# Altium project motordriver-v5.2.PrjPcb (part 1 of 3)
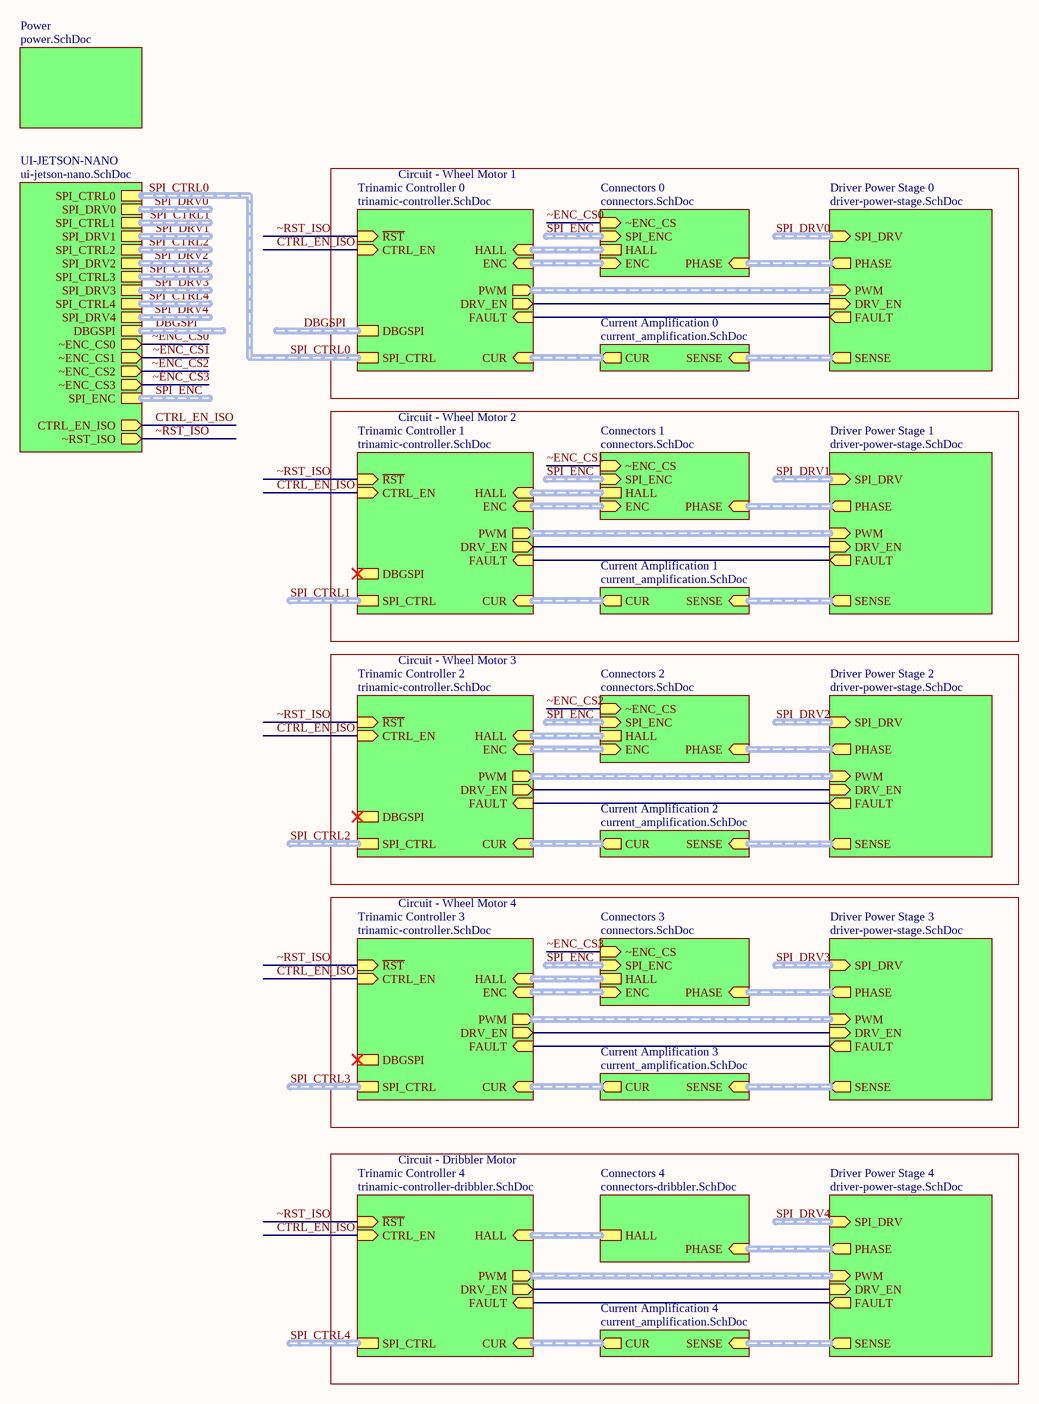
[diagram p0: motordriver-v5.1_top-level.SchDoc]
13 sheets, 777 parts. Net scope: hierarchical (ports join the sheet entries above them; power ports are global).
Board files: motordriver-v5.2.PcbDoc, motordriver-v5.2 - panel.PcbDoc
Sheets:
  motordriver-v5.1_top-level.SchDoc
    Driver Power Stage 0 = driver-power-stage.SchDoc
    Trinamic Controller 0 = trinamic-controller.SchDoc
    Connectors 0 = connectors.SchDoc
    Current Amplification 0 = current_amplification.SchDoc
    Power = power.SchDoc
    UI-JETSON-NANO = ui-jetson-nano.SchDoc
      LP Filter 0 = low-pass-filter.SchDoc
      U_isolation_0 = isolation.SchDoc
      U_isolation_1 = isolation.SchDoc
      U_isolation_2 = isolation-alt.SchDoc
      Demux 0 = demux.SchDoc
      Demux 1 = demux.SchDoc
      Demux 2 = demux.SchDoc
      Demux 3 = demux.SchDoc
      Demux 4 = demux.SchDoc
      U_isolation_3 = isolation-alt.SchDoc
      LP Filter 1 = low-pass-filter.SchDoc
      LP Filter 3 = low-pass-filter.SchDoc
      LP Filter 4 = low-pass-filter.SchDoc
      LP Filter 5 = low-pass-filter.SchDoc
      LP Filter 6 = low-pass-filter.SchDoc
      LP Filter 7 = low-pass-filter.SchDoc
      LP Filter 8 = low-pass-filter.SchDoc
      LP Filter 9 = low-pass-filter.SchDoc
      LP Filter 10 = low-pass-filter.SchDoc
      LP Filter 2 = low-pass-filter.SchDoc
      LP Filter 11 = low-pass-filter.SchDoc
    Driver Power Stage 4 = driver-power-stage.SchDoc
    Trinamic Controller 4 = trinamic-controller-dribbler.SchDoc
    Connectors 4 = connectors-dribbler.SchDoc
    Current Amplification 4 = current_amplification.SchDoc
    Driver Power Stage 1 = driver-power-stage.SchDoc
    Trinamic Controller 1 = trinamic-controller.SchDoc
    Connectors 1 = connectors.SchDoc
    Current Amplification 1 = current_amplification.SchDoc
    Driver Power Stage 2 = driver-power-stage.SchDoc
    Trinamic Controller 2 = trinamic-controller.SchDoc
    Connectors 2 = connectors.SchDoc
    Current Amplification 2 = current_amplification.SchDoc
    Driver Power Stage 3 = driver-power-stage.SchDoc
    Trinamic Controller 3 = trinamic-controller.SchDoc
    Connectors 3 = connectors.SchDoc
    Current Amplification 3 = current_amplification.SchDoc

## Sheet motordriver-v5.1_top-level.SchDoc
size 420 x 297 mm; SheetNumber: 1; SheetTotal: 13

### Sub-sheets
Connectors 0 = connectors.SchDoc: PHASE (in, harness PHASE), HALL (harness HALL), ENC (in, harness ENC), SPI_ENC (in, harness SPI_ENC), ~ENC_CS (in)
Connectors 1 = connectors.SchDoc: PHASE (in, harness PHASE), HALL (harness HALL), ENC (in, harness ENC), SPI_ENC (in, harness SPI_ENC), ~ENC_CS (in)
Connectors 2 = connectors.SchDoc: PHASE (in, harness PHASE), HALL (harness HALL), ENC (in, harness ENC), SPI_ENC (in, harness SPI_ENC), ~ENC_CS (in)
Connectors 3 = connectors.SchDoc: PHASE (in, harness PHASE), HALL (harness HALL), ENC (in, harness ENC), SPI_ENC (in, harness SPI_ENC), ~ENC_CS (in)
Connectors 4 = connectors-dribbler.SchDoc: PHASE (in, harness PHASE), HALL (harness HALL)
Current Amplification 0 = current_amplification.SchDoc: SENSE (in, harness SENSE), CUR (out, harness CUR)
Current Amplification 1 = current_amplification.SchDoc: SENSE (in, harness SENSE), CUR (out, harness CUR)
Current Amplification 2 = current_amplification.SchDoc: SENSE (in, harness SENSE), CUR (out, harness CUR)
Current Amplification 3 = current_amplification.SchDoc: SENSE (in, harness SENSE), CUR (out, harness CUR)
Current Amplification 4 = current_amplification.SchDoc: SENSE (in, harness SENSE), CUR (out, harness CUR)
Driver Power Stage 0 = driver-power-stage.SchDoc: DRV_EN (in), PWM (in, harness PWM), FAULT (out), SENSE (out, harness SENSE), PHASE (out, harness PHASE), SPI_DRV (in, harness DRV)
Driver Power Stage 1 = driver-power-stage.SchDoc: DRV_EN (in), PWM (in, harness PWM), FAULT (out), SENSE (out, harness SENSE), PHASE (out, harness PHASE), SPI_DRV (in, harness DRV)
Driver Power Stage 2 = driver-power-stage.SchDoc: DRV_EN (in), PWM (in, harness PWM), FAULT (out), SENSE (out, harness SENSE), PHASE (out, harness PHASE), SPI_DRV (in, harness DRV)
Driver Power Stage 3 = driver-power-stage.SchDoc: DRV_EN (in), PWM (in, harness PWM), FAULT (out), SENSE (out, harness SENSE), PHASE (out, harness PHASE), SPI_DRV (in, harness DRV)
Driver Power Stage 4 = driver-power-stage.SchDoc: DRV_EN (in), PWM (in, harness PWM), FAULT (out), SENSE (out, harness SENSE), PHASE (out, harness PHASE), SPI_DRV (in, harness DRV)
Power = power.SchDoc: no entries
Trinamic Controller 0 = trinamic-controller.SchDoc: ~{RST} (in), CUR (in, harness CUR), DRV_EN (out), CTRL_EN (in), PWM (out, harness PWM), HALL (in, harness HALL), FAULT (in), ENC (in, harness ENC), SPI_CTRL (harness CTRL), DBGSPI (harness DRV)
Trinamic Controller 1 = trinamic-controller.SchDoc: ~{RST} (in), CUR (in, harness CUR), DRV_EN (out), CTRL_EN (in), PWM (out, harness PWM), HALL (in, harness HALL), FAULT (in), ENC (in, harness ENC), SPI_CTRL (harness CTRL), DBGSPI (harness DRV)
Trinamic Controller 2 = trinamic-controller.SchDoc: ~{RST} (in), CUR (in, harness CUR), DRV_EN (out), CTRL_EN (in), PWM (out, harness PWM), HALL (in, harness HALL), FAULT (in), ENC (in, harness ENC), SPI_CTRL (harness CTRL), DBGSPI (harness DRV)
Trinamic Controller 3 = trinamic-controller.SchDoc: ~{RST} (in), CUR (in, harness CUR), DRV_EN (out), CTRL_EN (in), PWM (out, harness PWM), HALL (in, harness HALL), FAULT (in), ENC (in, harness ENC), SPI_CTRL (harness CTRL), DBGSPI (harness DRV)
Trinamic Controller 4 = trinamic-controller-dribbler.SchDoc: ~{RST} (in), CUR (in, harness CUR), DRV_EN (out), CTRL_EN (in), PWM (out, harness PWM), HALL (in, harness HALL), FAULT (in), SPI_CTRL (harness CTRL)
UI-JETSON-NANO = ui-jetson-nano.SchDoc: SPI_CTRL0 (harness CTRL), SPI_DRV0 (harness DRV), SPI_ENC (harness SPI_ENC), ~ENC_CS0 (out), ~ENC_CS1 (out), ~ENC_CS2 (out), ~ENC_CS3 (out), SPI_CTRL4 (harness CTRL), SPI_CTRL1 (harness CTRL), SPI_DRV1 (harness DRV), SPI_CTRL2 (harness CTRL), SPI_DRV2 (harness DRV), SPI_CTRL3 (harness CTRL), SPI_DRV3 (harness DRV), SPI_DRV4 (harness DRV), ~RST_ISO (out), CTRL_EN_ISO (out), DBGSPI (harness DRV)

### Nets
CTRL_EN_ISO: sheet Trinamic Controller 0/CTRL_EN, sheet UI-JETSON-NANO/CTRL_EN_ISO, sheet Trinamic Controller 4/CTRL_EN, sheet Trinamic Controller 1/CTRL_EN, sheet Trinamic Controller 2/CTRL_EN, sheet Trinamic Controller 3/CTRL_EN
DRV_EN: sheet Driver Power Stage 0/DRV_EN, sheet Trinamic Controller 0/DRV_EN
DRV_EN: sheet Driver Power Stage 4/DRV_EN, sheet Trinamic Controller 4/DRV_EN  [a separate net that carries the same name]
DRV_EN: sheet Driver Power Stage 1/DRV_EN, sheet Trinamic Controller 1/DRV_EN  [a separate net that carries the same name]
DRV_EN: sheet Driver Power Stage 2/DRV_EN, sheet Trinamic Controller 2/DRV_EN  [a separate net that carries the same name]
DRV_EN: sheet Driver Power Stage 3/DRV_EN, sheet Trinamic Controller 3/DRV_EN  [a separate net that carries the same name]
FAULT: sheet Driver Power Stage 0/FAULT, sheet Trinamic Controller 0/FAULT
FAULT: sheet Driver Power Stage 4/FAULT, sheet Trinamic Controller 4/FAULT  [a separate net that carries the same name]
FAULT: sheet Driver Power Stage 1/FAULT, sheet Trinamic Controller 1/FAULT  [a separate net that carries the same name]
FAULT: sheet Driver Power Stage 2/FAULT, sheet Trinamic Controller 2/FAULT  [a separate net that carries the same name]
FAULT: sheet Driver Power Stage 3/FAULT, sheet Trinamic Controller 3/FAULT  [a separate net that carries the same name]
~ENC_CS0: sheet Connectors 0/~ENC_CS, sheet UI-JETSON-NANO/~ENC_CS0
~ENC_CS1: sheet UI-JETSON-NANO/~ENC_CS1, sheet Connectors 1/~ENC_CS
~ENC_CS2: sheet UI-JETSON-NANO/~ENC_CS2, sheet Connectors 2/~ENC_CS
~ENC_CS3: sheet UI-JETSON-NANO/~ENC_CS3, sheet Connectors 3/~ENC_CS
~RST_ISO: sheet Trinamic Controller 0/~{RST}, sheet UI-JETSON-NANO/~RST_ISO, sheet Trinamic Controller 4/~{RST}, sheet Trinamic Controller 1/~{RST}, sheet Trinamic Controller 2/~{RST}, sheet Trinamic Controller 3/~{RST}

### Buses and harness runs
harness DBGSPI = sheet Trinamic Controller 0/DBGSPI
harness DBGSPI = sheet UI-JETSON-NANO/DBGSPI
harness sheet Connectors 0/ENC = sheet Trinamic Controller 0/ENC
harness sheet Connectors 0/HALL = sheet Trinamic Controller 0/HALL
harness sheet Connectors 0/PHASE = sheet Driver Power Stage 0/PHASE
harness sheet Connectors 1/ENC = sheet Trinamic Controller 1/ENC
harness sheet Connectors 1/HALL = sheet Trinamic Controller 1/HALL
harness sheet Connectors 1/PHASE = sheet Driver Power Stage 1/PHASE
harness sheet Connectors 2/ENC = sheet Trinamic Controller 2/ENC
harness sheet Connectors 2/HALL = sheet Trinamic Controller 2/HALL
harness sheet Connectors 2/PHASE = sheet Driver Power Stage 2/PHASE
harness sheet Connectors 3/ENC = sheet Trinamic Controller 3/ENC
harness sheet Connectors 3/HALL = sheet Trinamic Controller 3/HALL
harness sheet Connectors 3/PHASE = sheet Driver Power Stage 3/PHASE
harness sheet Connectors 4/HALL = sheet Trinamic Controller 4/HALL
harness sheet Connectors 4/PHASE = sheet Driver Power Stage 4/PHASE
harness sheet Current Amplification 0/CUR = sheet Trinamic Controller 0/CUR
harness sheet Current Amplification 0/SENSE = sheet Driver Power Stage 0/SENSE
harness sheet Current Amplification 1/CUR = sheet Trinamic Controller 1/CUR
harness sheet Current Amplification 1/SENSE = sheet Driver Power Stage 1/SENSE
harness sheet Current Amplification 2/CUR = sheet Trinamic Controller 2/CUR
harness sheet Current Amplification 2/SENSE = sheet Driver Power Stage 2/SENSE
harness sheet Current Amplification 3/CUR = sheet Trinamic Controller 3/CUR
harness sheet Current Amplification 3/SENSE = sheet Driver Power Stage 3/SENSE
harness sheet Current Amplification 4/CUR = sheet Trinamic Controller 4/CUR
harness sheet Current Amplification 4/SENSE = sheet Driver Power Stage 4/SENSE
harness sheet Driver Power Stage 0/PWM = sheet Trinamic Controller 0/PWM
harness sheet Driver Power Stage 1/PWM = sheet Trinamic Controller 1/PWM
harness sheet Driver Power Stage 2/PWM = sheet Trinamic Controller 2/PWM
harness sheet Driver Power Stage 3/PWM = sheet Trinamic Controller 3/PWM
harness sheet Driver Power Stage 4/PWM = sheet Trinamic Controller 4/PWM
harness SPI_CTRL0 = sheet Trinamic Controller 0/SPI_CTRL = sheet UI-JETSON-NANO/SPI_CTRL0
harness SPI_CTRL1 = sheet Trinamic Controller 1/SPI_CTRL
harness SPI_CTRL1 = sheet UI-JETSON-NANO/SPI_CTRL1
harness SPI_CTRL2 = sheet Trinamic Controller 2/SPI_CTRL
harness SPI_CTRL2 = sheet UI-JETSON-NANO/SPI_CTRL2
harness SPI_CTRL3 = sheet Trinamic Controller 3/SPI_CTRL
harness SPI_CTRL3 = sheet UI-JETSON-NANO/SPI_CTRL3
harness SPI_CTRL4 = sheet Trinamic Controller 4/SPI_CTRL
harness SPI_CTRL4 = sheet UI-JETSON-NANO/SPI_CTRL4
harness SPI_DRV0 = sheet Driver Power Stage 0/SPI_DRV
harness SPI_DRV0 = sheet UI-JETSON-NANO/SPI_DRV0
harness SPI_DRV1 = sheet Driver Power Stage 1/SPI_DRV
harness SPI_DRV1 = sheet UI-JETSON-NANO/SPI_DRV1
harness SPI_DRV2 = sheet Driver Power Stage 2/SPI_DRV
harness SPI_DRV2 = sheet UI-JETSON-NANO/SPI_DRV2
harness SPI_DRV3 = sheet Driver Power Stage 3/SPI_DRV
harness SPI_DRV3 = sheet UI-JETSON-NANO/SPI_DRV3
harness SPI_DRV4 = sheet Driver Power Stage 4/SPI_DRV
harness SPI_DRV4 = sheet UI-JETSON-NANO/SPI_DRV4
harness SPI_ENC = sheet Connectors 0/SPI_ENC
harness SPI_ENC = sheet Connectors 1/SPI_ENC
harness SPI_ENC = sheet Connectors 2/SPI_ENC
harness SPI_ENC = sheet Connectors 3/SPI_ENC
harness SPI_ENC = sheet UI-JETSON-NANO/SPI_ENC

### Notes on the sheet
- Circuit - Wheel Motor 1
- Circuit - Wheel Motor 2
- Circuit - Wheel Motor 3
- Circuit - Wheel Motor 4
- Circuit - Dribbler Motor
- TITLE
- SCALE:
- A3
- SIZE
- FILE NAME
- SHEET
- OF
- REV

## Sheet driver-power-stage.SchDoc
size A4; SheetNumber: 11; SheetTotal: 13
Used 5 times, as channels Driver Power Stage 0, Driver Power Stage 4, Driver Power Stage 1, Driver Power Stage 2, Driver Power Stage 3. Parts and nets are listed once, with the designators drawn on the sheet.
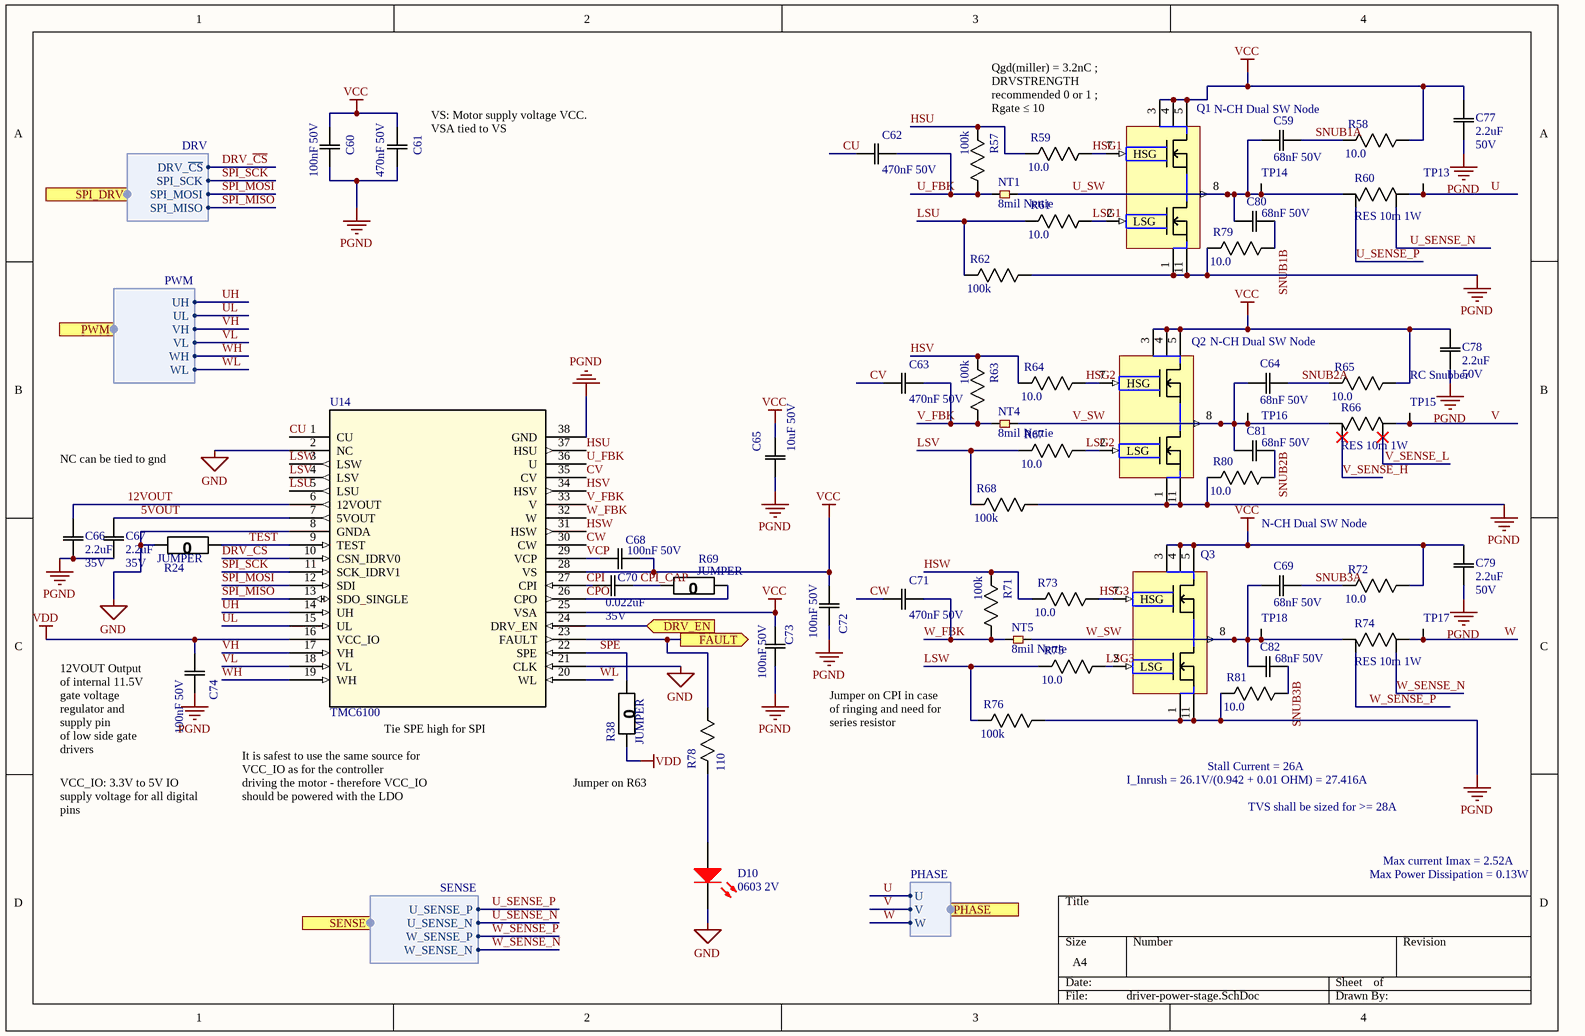
[diagram p1: driver-power-stage.SchDoc]

### Parts
C59  68nF 50V  [0603]
C60  100nF 50V  [0603]
C61  470nF 50V  [0603]
C62  470nF 50V  [0603]
C63  470nF 50V  [0603]
C64  68nF 50V  [0603]
C65  10uF 50V  [0805]
C66  value 2.2uF  Rating: 35V  [0603]  (hidden comment: 2.2uF 35V)
C67  value 2.2uF  Rating: 35V  [0603]  (hidden comment: 2.2uF 35V)
C68  100nF 50V  [0603]
C69  68nF 50V  [0603]
C70  value 0.022uF  Rating: 35V  [0603]  (hidden comment: 0.022uF 35V)
C71  470nF 50V  [0603]
C72  100nF 50V  [0603]
C73  100nF 50V  [0603]
C74  100nF 50V  [0603]
C77  Rating: 50V  [0603]  (hidden comment: 2.2uF)
C78  Rating: 50V  [0603]  (hidden comment: 2.2uF)
C79  Rating: 50V  [0603]  (hidden comment: 2.2uF)
C80  68nF 50V  [0603]
C81  68nF 50V  [0603]
C82  68nF 50V  [0603]
D10  0603 2V  [0603 - LED2]
NT1  8mil Nettie  [NT_8mil]  (net tie, no BOM)
NT4  8mil Nettie  [NT_8mil]  (net tie, no BOM)
NT5  8mil Nettie  [NT_8mil]  (net tie, no BOM)
Q1  N-CH Dual SW Node  [12-PowerWQFN]
Q2  N-CH Dual SW Node  [12-PowerWQFN]
Q3  N-CH Dual SW Node  [12-PowerWQFN]
R24  JUMPER  [0603]
R38  JUMPER  [0603]
R57  100k  [0603]
R58  10.0  [0603]
R59  10.0  [0603]
R60  RES 10m 1W  [1206 - Current Sense]
R61  10.0  [0603]
R62  100k  [0603]
R63  100k  [0603]
R64  10.0  [0603]
R65  10.0  [0603]
R66  RES 10m 1W  [1206 - Current Sense]
R67  10.0  [0603]
R68  100k  [0603]
R69  JUMPER  [0603]
R71  100k  [0603]
R72  10.0  [0603]
R73  10.0  [0603]
R74  RES 10m 1W  [1206 - Current Sense]
R75  10.0  [0603]
R76  100k  [0603]
R78  110  [0603]
R79  10.0  [0603]
R80  10.0  [0603]
R81  10.0  [0603]
TP13  U_SL  [TP]  (value not drawn)  (no BOM)
TP14  U_SH  [TP]  (value not drawn)  (no BOM)
TP15  V_SL  [TP]  (value not drawn)  (no BOM)
TP16  V_SH  [TP]  (value not drawn)  (no BOM)
TP17  W_SL  [TP]  (value not drawn)  (no BOM)
TP18  W_SH  [TP]  (value not drawn)  (no BOM)
U14  TMC6100  [QFN50P700X700X85_HS-38N]

### Ports
DRV_EN (in), FAULT (out), PHASE (harness PHASE), PWM (harness PWM), SENSE (harness SENSE), SPI_DRV (harness DRV)

### Harnesses
PWM: VL, WH, WL, VH, UL, UH
SENSE: U_SENSE_P, U_SENSE_N, W_SENSE_P, W_SENSE_N
PHASE: U, V, W
DRV: SPI_SCK, SPI_MISO, SPI_MOSI, DRV_~{CS}

### Nets
GND: D10.2(K) R24.2(R2) U14.2(NC) U14.8(GNDA) U14.21(CLK)
PGND: C60.2(C2) C61.2(C2) C65.1(C1) C66.1(C1) C67.1(C1) C72.2(C2) C73.2(C2) C74.2(C2) C77.1(C1) C78.1(C1) C79.1(C1) Q1.1(GND) Q1.11(GND) Q2.1(GND) Q2.11(GND) Q3.1(GND) Q3.11(GND) R62.1(R1) R68.1(R1) R76.1(R1) R79.2(R2) R80.2(R2) R81.2(R2) U14.38(GND)
VCC: C60.1(C1) C61.1(C1) C65.2(C2) C68.2(C2) C72.1(C1) C73.1(C1) C77.2(C2) C78.2(C2) C79.2(C2) Q1.3(V+) Q1.4(V+) Q1.5(V+) Q2.3(V+) Q2.4(V+) Q2.5(V+) Q3.3(V+) Q3.4(V+) Q3.5(V+) R58.1(R1) R65.1(R1) R72.1(R1) U14.25(VSA) U14.28(VS)
VDD: C74.1(C1) R38.2(R2) U14.16(VCC_IO)
5VOUT: C67.2(C2) U14.7(5VOUT)
12VOUT: C66.2(C2) U14.6(12VOUT)
CPI: C70.1(C1) U14.27(CPI)
CPI_CAP: C70.2(C2) R69.2(R2)
CPO: R69.1(R1) U14.26(CPO)
CU: C62.1(C1) U14.1(CU)
CV: C63.1(C1) U14.35(CV)
CW: C71.1(C1) U14.30(CW)
DRV_~{CS}: U14.10(CSN_IDRV0) ; port SPI_DRV.DRV_~{CS}
DRV_EN: U14.24(DRV_EN) ; port DRV_EN
FAULT: R78.1(R1) U14.23(FAULT) ; port FAULT
HSG1: Q1.7(HSG) R59.1(R1)
HSG2: Q2.7(HSG) R64.1(R1)
HSG3: Q3.7(HSG) R73.1(R1)
HSU: R57.2(R2) R59.2(R2) U14.37(HSU)
HSV: R63.2(R2) R64.2(R2) U14.34(HSV)
HSW: R71.2(R2) R73.2(R2) U14.31(HSW)
LSG1: Q1.2(LSG) R61.1(R1)
LSG2: Q2.2(LSG) R67.1(R1)
LSG3: Q3.2(LSG) R75.1(R1)
LSU: R61.2(R2) R62.2(R2) U14.5(LSU)
LSV: R67.2(R2) R68.2(R2) U14.4(LSV)
LSW: R75.2(R2) R76.2(R2) U14.3(LSW)
SNUB1A: C59.2(C2) R58.2(R2)
SNUB1B: C80.2(C2) R79.1(R1)
SNUB2A: C64.2(C2) R65.2(R2)
SNUB2B: C81.2(C2) R80.1(R1)
SNUB3A: C69.2(C2) R72.2(R2)
SNUB3B: C82.2(C2) R81.1(R1)
SPE: R38.1(R1) U14.22(SPE)
SPI_MISO: U14.13(SDO_SINGLE) ; port SPI_DRV.SPI_MISO
SPI_MOSI: U14.12(SDI) ; port SPI_DRV.SPI_MOSI
SPI_SCK: U14.11(SCK_IDRV1) ; port SPI_DRV.SPI_SCK
TEST: R24.1(R1) U14.9(TEST)
U: R60.1(R1) TP13.1 ; port PHASE.U
U_FBK: C62.2(C2) NT1.2 R57.1(R1) U14.36(U)
U_SENSE_N: R60.S1 ; port SENSE.U_SENSE_N
U_SENSE_P: R60.S2 ; port SENSE.U_SENSE_P
U_SW: C59.1(C1) C80.1(C1) NT1.1 Q1.8(SW) R60.2(R2) TP14.1
UH: U14.14(UH) ; port PWM.UH
UL: U14.15(UL) ; port PWM.UL
V: R66.1(R1) TP15.1 ; port PHASE.V
V_FBK: C63.2(C2) NT4.2 R63.1(R1) U14.33(V)
V_SENSE_H: R66.S2
V_SENSE_L: R66.S1
V_SW: C64.1(C1) C81.1(C1) NT4.1 Q2.8(SW) R66.2(R2) TP16.1
VCP: C68.1(C1) U14.29(VCP)
VH: U14.17(VH) ; port PWM.VH
VL: U14.18(VL) ; port PWM.VL
W: R74.1(R1) TP17.1 ; port PHASE.W
W_FBK: C71.2(C2) NT5.2 R71.1(R1) U14.32(W)
W_SENSE_N: R74.S1 ; port SENSE.W_SENSE_N
W_SENSE_P: R74.S2 ; port SENSE.W_SENSE_P
W_SW: C69.1(C1) C82.1(C1) NT5.1 Q3.8(SW) R74.2(R2) TP18.1
WH: U14.19(WH) ; port PWM.WH
WL: U14.20(WL) ; port PWM.WL
NetD10_1: D10.1(A) R78.2(R2)

### Channels
Driver Power Stage 0: designators end in A; ports DRV_EN=DRV_EN FAULT=FAULT
Driver Power Stage 4: designators end in B; ports DRV_EN=DRV_EN FAULT=FAULT
Driver Power Stage 1: designators end in C; ports DRV_EN=DRV_EN FAULT=FAULT
Driver Power Stage 2: designators end in D; ports DRV_EN=DRV_EN FAULT=FAULT
Driver Power Stage 3: designators end in E; ports DRV_EN=DRV_EN FAULT=FAULT

### Notes on the sheet
- Text
- (near Q1) Qgd(miller) = 3.2nC ; DRVSTRENGTH recommended 0 or 1 ; Rgate ≤ 10
- (near C61) VS: Motor supply voltage VCC. VSA tied to VS
- (near C78) RC Snubber
- NC can be tied to gnd
- (near C74) 12VOUT Output of internal 11.5V gate voltage regulator and supply pin
  of low side gate drivers
- Tie SPE high for SPI
- Jumper on CPI in case of ringing and need for series resistor
- I_Inrush = 26.1V/(0.942 + 0.01 OHM) = 27.416A
- Stall Current = 26A
- VCC_IO: 3.3V to 5V IO supply voltage for all digital pins
- It is safest to use the same source for VCC_IO as for the controller
  driving the motor - therefore VCC_IO should be powered with the LDO
- Jumper on R63
- TVS shall be sized for >= 28A
- Max Power Dissipation = 0.13W
- Max current Imax = 2.52A

### Library data of the parts
C59 C64 C69 C80-C82 = CAP 0.068uF 50V: Default Symbol for Capacitors; Temperature Coefficient: X7R; Tolerance: 10%; Part Number: CAP 0.068uF 50V; Value: 0.068uF; Rating: 50V
C60 C68 C72-C74 = CAP 100nF 50V: Default Symbol for Capacitors; Manufacturer Part Number 1: CC0603KPX7R9BB104; Tolerance: 10%; Temperature Coefficient: X7R; VALUE: 100nF; Rating: 50V; Part Number: CAP 100nF 50V; Supplier 1: Digi-Key; Supplier Part Number 1: 311-3567-1-ND; Manufacturer Part Number 2: 0805J0500104KJT; Supplier 2: Digi-Key; Supplier Part Number 2: 1608-1458-1-ND
C61-C63 C71 = CAP 470nF 50V: Default Symbol for Capacitors; Manufacturer Part Number 1: C1608X7R1H474K080AC; Tolerance: 10%; Temperature Coefficient: X7R; VALUE: 470nF; Rating: 50V; Part Number: CAP 470nF 50V; Supplier 1: Digi-Key; Supplier Part Number 1: 445-5952-1-ND; Manufacturer Part Number 2: CL21B474KBFNNNG; Supplier 2: Digi-Key; Supplier Part Number 2: 1276-6482-1-ND
C65 = CAP 10uF 50V: Default Symbol for Capacitors; Manufacturer Part Number 1: GRM21BR61H106KE43L; Tolerance: 10%; Temperature Coefficient: X5R; VALUE: 10uF; Rating: 50V; Part Number: CAP 10uF 50V; Supplier 1: Digi-Key; Supplier Part Number 1: 490-18663-1-ND; Manufacturer Part Number 2: CL32B106KBJNNWE; Supplier 2: Digi-Key; Supplier Part Number 2: 1276-3388-1-ND
C66 C67 = CAP 2.2uF 35V: Default Symbol for Capacitors; Manufacturer Part Number 1: C1608X5R1V225K080AC; Tolerance: 10%; Temperature Coefficient: X5R; Part Number: CAP 2.2uF 35V; Supplier 1: Digi-Key; Supplier Part Number 1: 445-8025-1-ND; Manufacturer Part Number 2: CGA4J1X7R1V225K125AE; Supplier 2: Digi-Key; Supplier Part Number 2: 445-8787-1-ND
C70 = CAP 0.022uF 35V: Default Symbol for Capacitors; Manufacturer Part Number 1: GMK107BJ223KAHT; Tolerance: 10%; Temperature Coefficient: X7R; Part Number: CAP 0.022uF 35V; Supplier 1: Digi-Key; Supplier Part Number 1: 587-3359-1-ND; Manufacturer Part Number 2: GMK212SD223KG-T; Supplier 2: Digi-Key; Supplier Part Number 2: 587-1122-1-ND
C77-C79 = CAP 2.2uF 50V: CAP CER 2.2UF 50V X5R 0603/0805; Manufacturer Part Number 1: GRM188R61H225KE11D; Tolerance: 10%; Package: 0603/0805; Temperature Coefficient: X5R; Operating Temperature: -55°C ~ 125°C; Value: 2.2uF; Part Number: CAP 2.2uF 50V; Supplier 1: Mouser; Supplier Part Number 1: 81-GRM188R61H225KE1D
D10 = LED RED SMD 0603: 0603 red led alingap 631nm-639nm water clear 18-180mcd 130d; Manufacturer Part Number 1: LTST-C190KRKT; Current Rating: 20mA; Supplier 1: Digi-Key; Supplier Part Number 1: 160-1436-1-ND; Part Number: LED RED SMD 0603; Supplier URL 1: https://www.digikey.ca/en/products/detail/lite-on-inc/LTST-C190KRKT/386817?s=N4IgTCBcDaIIwDYAMBaOAWAzAtKByAIiALoC%2BQA; Pin Count: 2; Voltage Rating - DC: 2V
NT1 NT4 NT5 = NT_8: 74LVC Series 5.5 V SMT 2-Channel Analog Multiplexer/Demultiplexer - TSSOP-8; Manufacturer Part Number 1: 74LVC1G53DP,125; Part Number: NT_8; Supplier 1: Digi-Key; Supplier Part Number 1: 1727-6078-1-ND; Supplier URL 1: https://www.digikey.ca/en/products/detail/nexperia-usa-inc/74LVC1G53DP-125/1300844
Q1-Q3 = MOSFET N-CH DUAL NTTFD4D0N04HLTWG: MOSFET N+N COMMON PHASE SW 40V 60A; Supplier 1: Digi-Key; Supplier Part Number 1: 488-NTTFD4D0N04HLTWGCT-ND; Part Number: MOSFET N-CH DUAL NTTFD4D0N04HLTWG; Supplier URL 1: https://www.digikey.ca/en/products/detail/onsemi/NTTFD4D0N04HLTWG/12181286?s=N4IgTCBcDaIHIBUEDEAiAWVAGOX0AkAZBAdQHEBhBEAXQF8g; Manufacturer Part Number 1: NTTFD4D0N04HLTWG
R24 R38 R69 = RES 0 JUMPER: RES SMD 0 OHM JUMPER GENERIC 0805; Manufacturer Part Number 1: RK73Z1JTTD; VALUE: 0; Package: 0805; Part Number: RES 0 JUMPER; Supplier 1: Digi-Key; Supplier Part Number 1: 2019-RK73Z1JTTDCT-ND; Supplier URL 1: https://www.digikey.ca/en/products/detail/koa-speer-electronics-inc/RK73Z1JTTD/9845478; Tolerance: N/A
R57 R62 R63 R68 R71 R76 = RES 100k 1/8W 5%: RES SMD 100K OHM 5% 1/8W 0805; Power (Watts): 0.125W; Package: 0805; VALUE: 100k; Tolerance: 5%; Part Number: RES 100k 1/8W 5%
R58 R59 R61 R64 R65 R67 R72 R73 R75 R79-R81 = RES 10.0 1/8W - 1%: Default Resistor Symbol; Manufacturer Part Number 1: RNCP0603FTD10R0; VALUE: 10; Power (Watts): 0.125W; Tolerance: 1%; Package: 0805; Part Number: RES 10.0 1/8W - 1%; Supplier 1: Digi-Key; Supplier Part Number 1: RNCP0603FTD10R0CT-ND; Manufacturer Part Number 2: RNCP0603FTD10R0; Supplier 2: Digi-Key; Supplier Part Number 2: RNCP0603FTD10R0CT-ND; Tolerance 2: 1%; Supplier URL 1: https://www.digikey.ca/en/products/detail/stackpole-electronics-inc/RNCP0603FTD10R0/2240074?s=N4IgTCBcDaIEoDkDCAFADANjQZgGIBUARARjTjSXxAF0BfIA; Supplier URL 2: https://www.digikey.ca/en/products/detail/stackpole-electronics-inc/RNCP0603FTD10R0/2240074?s=N4IgTCBcDaIEoDkDCAFADANjQZgGIBUARARjTjSXxAF0BfIA
R60 R66 R74 = RES 10m 1W: RES SMD 0.01 OHM 1% 1W 1206; Manufacturer Part Number 1: CSRL1-0R01F8; Part Number: RES 10m 1W; Value: 10m; Tolerance: 1%; Supplier 1: Digi-Key; Supplier Part Number 1: 696-1845-1-ND; Supplier URL 1: https://www.digikey.ca/en/products/detail/riedon/CSRL1-0R01F8/9666060?s=N4IgTCBcDaIGwE44FoCMAOALAVjcgcgCIgC6AvkA
R78 = RES 110.0 1/8W - 1%: Default Resistor Symbol; Manufacturer Part Number 1: RMCF0603FT110R; Power (Watts): 0.125W; Tolerance: 1%; Package: 0805; Value: 110; Part Number: RES 110.0 1/8W - 1%; Supplier 1: Digi-Key; Supplier Part Number 1: RMCF0603FT110RCT-ND; Supplier URL 1: https://www.digikey.ca/en/products/detail/stackpole-electronics-inc/RMCF0603FT110R/1761268
TP13-TP18 = Test Point (Via): Part Number: Test Point (Via)
U14 = TMC6100: GATE DRIVER IC 8-60V QFN37; Manufacturer Part Number 1: TMC6100-LA; Supplier 1: Newark; Supplier Part Number 1: 54AH1603; Part Number: TMC6100; Supplier URL 1: https://canada.newark.com/trinamic/tmc6100-la/motor-driver-40-to-125deg-c-rohs/dp/54AH1603?ost=54ah1603

## Sheet trinamic-controller.SchDoc
size B; SheetNumber: 8; SheetTotal: 13
Used 4 times, as channels Trinamic Controller 0, Trinamic Controller 1, Trinamic Controller 2, Trinamic Controller 3. Parts and nets are listed once, with the designators drawn on the sheet.
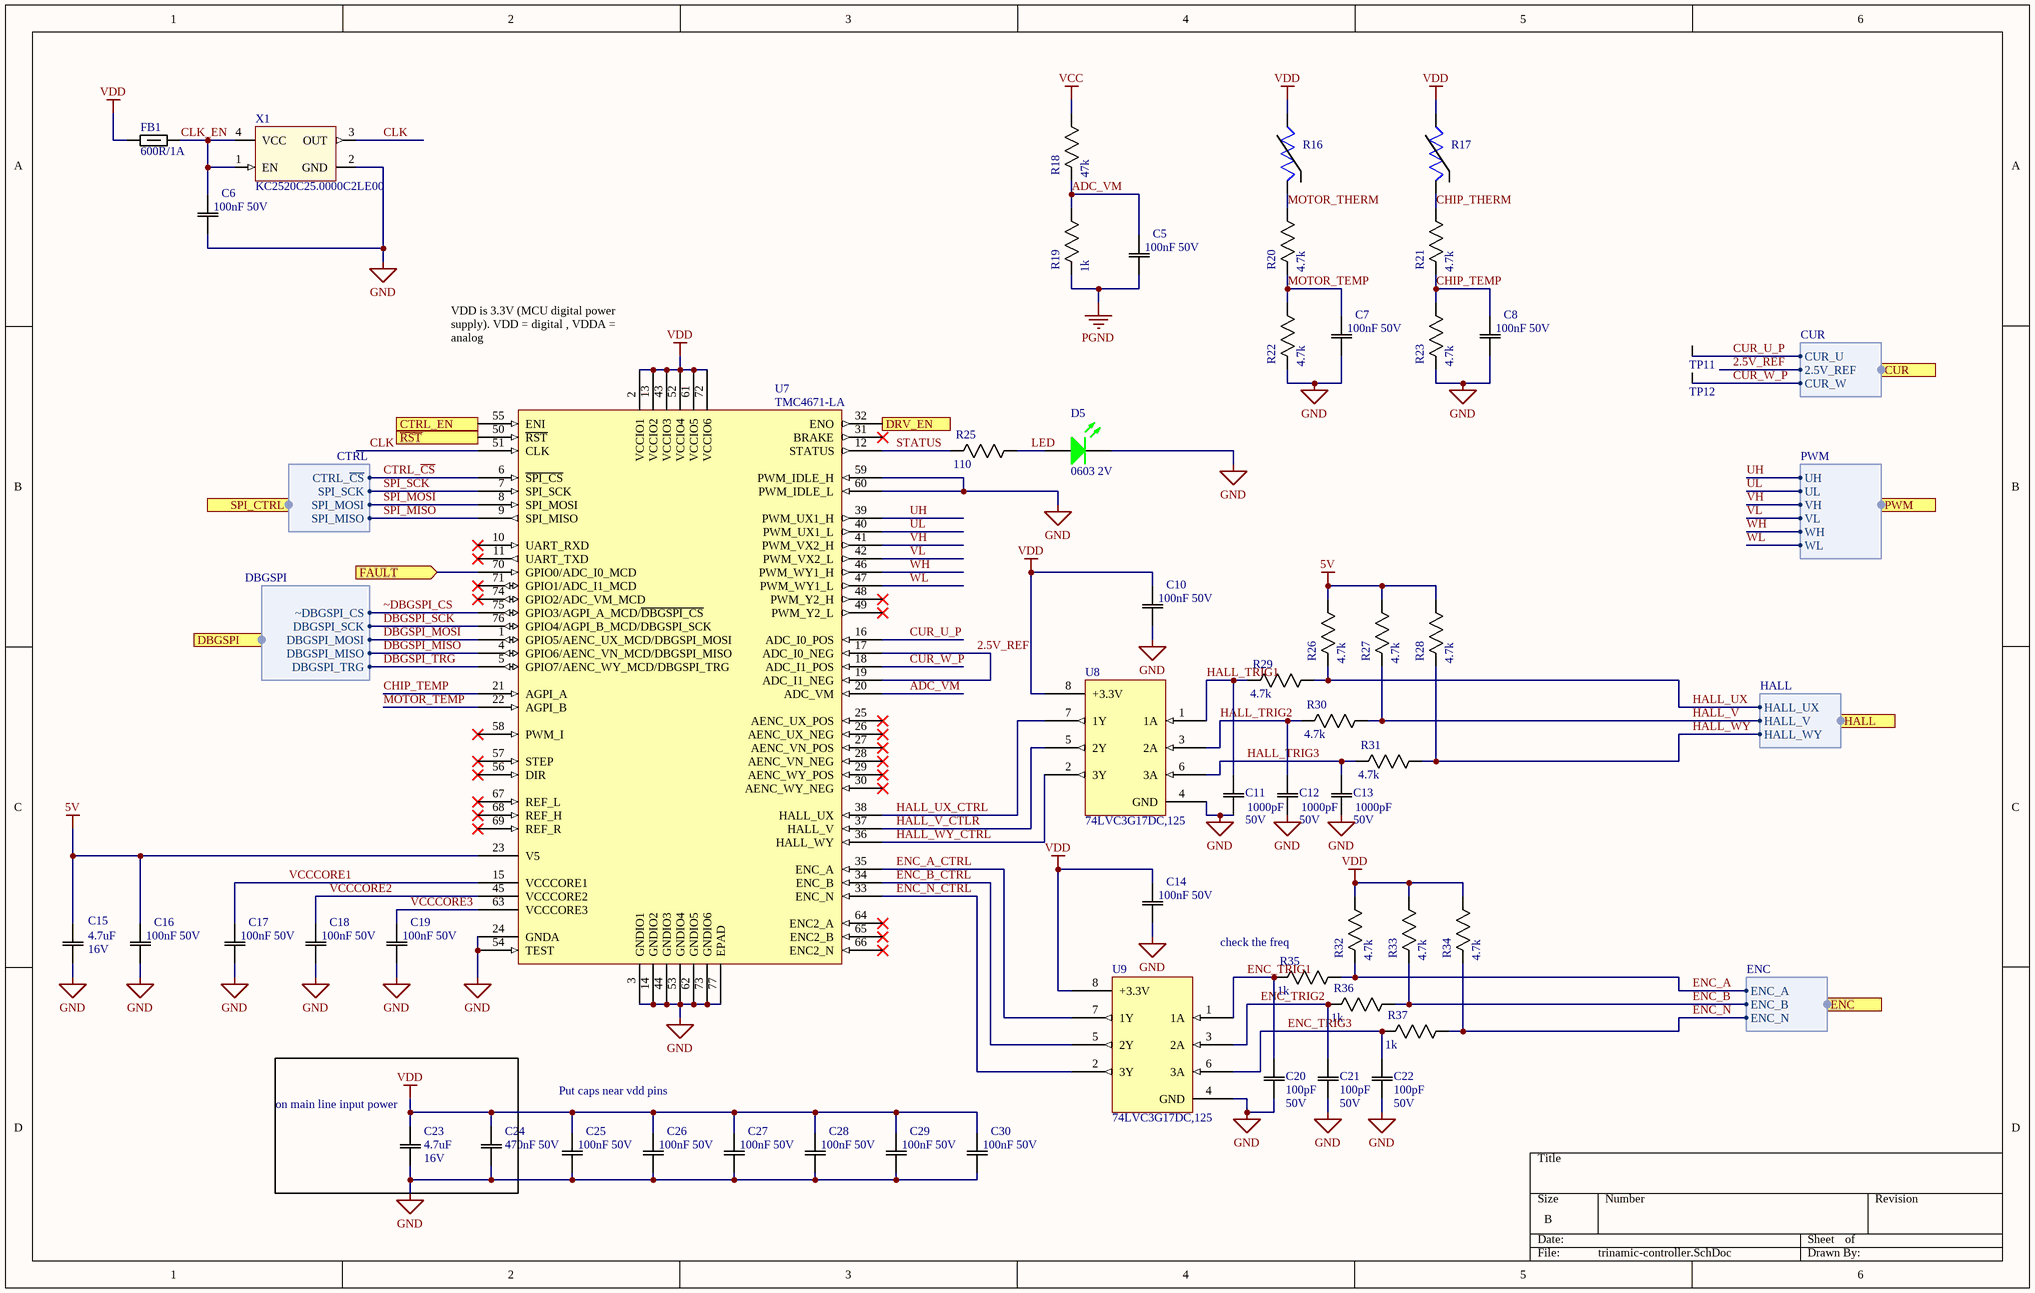
[diagram p2: trinamic-controller.SchDoc]

### Parts
C5  100nF 50V  [0603]
C6  100nF 50V  [0603]
C7  100nF 50V  [0603]
C8  100nF 50V  [0603]
C10  100nF 50V  [0603]
C11  value 1000pF  Rating: 50V  [0603]  (hidden comment: 1000pF 50V)
C12  value 1000pF  Rating: 50V  [0603]  (hidden comment: 1000pF 50V)
C13  value 1000pF  Rating: 50V  [0603]  (hidden comment: 1000pF 50V)
C14  100nF 50V  [0603]
C15  value 4.7uF  Rating: 16V  [0603]  (hidden comment: 4.7uF 16V)
C16  100nF 50V  [0603]
C17  100nF 50V  [0603]
C18  100nF 50V  [0603]
C19  100nF 50V  [0603]
C20  value 100pF  Rating: 50V  [0603]  (hidden comment: 100pF 50V)
C21  value 100pF  Rating: 50V  [0603]  (hidden comment: 100pF 50V)
C22  value 100pF  Rating: 50V  [0603]  (hidden comment: 100pF 50V)
C23  value 4.7uF  Rating: 16V  [0603]  (hidden comment: 4.7uF 16V)
C24  470nF 50V  [0603]
C25  100nF 50V  [0603]
C26  100nF 50V  [0603]
C27  100nF 50V  [0603]
C28  100nF 50V  [0603]
C29  100nF 50V  [0603]
C30  100nF 50V  [0603]
D5  0603 2V  [0603 - LED]
FB1  600R/1A  [0603]
R16  RES NTC 10k  [THERMISTOR TH]  (value not drawn)  (no BOM)
R17  RES NTC 10k  [0603]  (value not drawn)
R18  47k  [0603]
R19  1k  [0603]
R20  4.7k  [0603]
R21  4.7k  [0603]
R22  4.7k  [0603]
R23  4.7k  [0603]
R25  110  [0603]
R26  4.7k  [0603]
R27  4.7k  [0603]
R28  4.7k  [0603]
R29  4.7k  [0603]
R30  4.7k  [0603]
R31  4.7k  [0603]
R32  4.7k  [0603]
R33  4.7k  [0603]
R34  4.7k  [0603]
R35  1k  [0603]
R36  1k  [0603]
R37  1k  [0603]
TP11  C_U  [TP]  (value not drawn)  (no BOM)
TP12  C_W  [TP]  (value not drawn)  (no BOM)
U7  TMC4671-LA  [QFN40P1050X650X90_HS-77N]
U8  74LVC3G17DC,125  [8-VSSOP]
U9  74LVC3G17DC,125  [8-VSSOP]
X1  KC2520C25.0000C2LE00  [KC2520C25.0000C2LE00]

### Blocks framed on the sheet
on main line input power: C23 C24

### Ports
CTRL_EN (in), CUR (harness CUR), DBGSPI (harness DBGSPI), DRV_EN (out), ENC (harness ENC), FAULT (in), HALL (harness HALL), PWM (harness PWM), SPI_CTRL (harness CTRL), ~{RST} (in)

### Harnesses
CUR: CUR_U, CUR_W, 2.5V_REF
PWM: VL, WH, WL, VH, UL, UH
HALL: HALL_UX, HALL_WY, HALL_V
ENC: ENC_A, ENC_N, ENC_B
CTRL: SPI_SCK, SPI_MISO, SPI_MOSI, CTRL_~{CS}
DBGSPI: ~DBGSPI_CS, DBGSPI_SCK, DBGSPI_MOSI, DBGSPI_MISO, DBGSPI_TRG

### Nets
5V: C15.2(C2) C16.2(C2) R26.1(R1) R27.1(R1) R28.1(R1) U7.23(V5)
GND: C6.1(C1) C7.1(C1) C8.1(C1) C10.1(C1) C11.1(C1) C12.1(C1) C13.1(C1) C14.1(C1) C15.1(C1) C16.1(C1) C17.1(C1) C18.1(C1) C19.1(C1) C20.1(C1) C21.1(C1) C22.1(C1) C23.1(C1) C24.1(C1) C25.1(C1) C26.1(C1) C27.1(C1) C28.1(C1) C29.1(C1) C30.1(C1) D5.2(K) R22.2(R2) R23.2(R2) U7.3(GNDIO1) U7.14(GNDIO2) U7.24(GNDA) U7.44(GNDIO3) U7.53(GNDIO4) U7.54(TEST) U7.59(PWM_IDLE_H) U7.60(PWM_IDLE_L) U7.62(GNDIO5) U7.73(GNDIO6) U7.77(EPAD) U8.4(GND) U9.4(GND) X1.2(GND)
PGND: C5.1(C1) R19.2(R2)
VCC: R18.1(R1)
VDD: C10.2(C2) C14.2(C2) C23.2(C2) C24.2(C2) C25.2(C2) C26.2(C2) C27.2(C2) C28.2(C2) C29.2(C2) C30.2(C2) FB1.1 R16.2 R17.2 R32.1(R1) R33.1(R1) R34.1(R1) U7.2(VCCIO1) U7.13(VCCIO2) U7.43(VCCIO3) U7.52(VCCIO4) U7.61(VCCIO5) U7.72(VCCIO6) U8.8(+3.3V) U9.8(+3.3V)
2.5V_REF: U7.17(ADC_I0_NEG) U7.19(ADC_I1_NEG) ; port CUR.2.5V_REF
ADC_VM: C5.2(C2) R18.2(R2) R19.1(R1) U7.20(ADC_VM)
CHIP_TEMP: C8.2(C2) R21.2(R2) R23.1(R1) U7.21(AGPI_A)
CHIP_THERM: R17.1 R21.1(R1)
CLK: U7.51(CLK) X1.3(OUT)
CLK_EN: C6.2(C2) FB1.2 X1.1(EN) X1.4(VCC)
CTRL_~{CS}: U7.6(~{SPI_CS}) ; port SPI_CTRL.CTRL_~{CS}
CTRL_EN: U7.55(ENI) ; port CTRL_EN
CUR_U_P: TP11.1 U7.16(ADC_I0_POS) ; port CUR.CUR_U
CUR_W_P: TP12.1 U7.18(ADC_I1_POS) ; port CUR.CUR_W
DBGSPI_MISO: U7.4(GPIO6/AENC_VN_MCD/DBGSPI_MISO) ; port DBGSPI.DBGSPI_MISO
DBGSPI_MOSI: U7.1(GPIO5/AENC_UX_MCD/DBGSPI_MOSI) ; port DBGSPI.DBGSPI_MOSI
DBGSPI_SCK: U7.76(GPIO4/AGPI_B_MCD/DBGSPI_SCK) ; port DBGSPI.DBGSPI_SCK
DBGSPI_TRG: U7.5(GPIO7/AENC_WY_MCD/DBGSPI_TRG) ; port DBGSPI.DBGSPI_TRG
DRV_EN: U7.32(ENO) ; port DRV_EN
ENC_A: R32.2(R2) R35.1(R1) ; port ENC.ENC_A
ENC_A_CTRL: U7.35(ENC_A) U9.7(1Y)
ENC_B: R33.2(R2) R36.1(R1) ; port ENC.ENC_B
ENC_B_CTRL: U7.34(ENC_B) U9.5(2Y)
ENC_N: R34.2(R2) R37.1(R1) ; port ENC.ENC_N
ENC_N_CTRL: U7.33(ENC_N) U9.2(3Y)
ENC_TRIG1: C20.2(C2) R35.2(R2) U9.1(1A)
ENC_TRIG2: C21.2(C2) R36.2(R2) U9.3(2A)
ENC_TRIG3: C22.2(C2) R37.2(R2) U9.6(3A)
FAULT: U7.70(GPIO0/ADC_I0_MCD) ; port FAULT
HALL_TRIG1: C11.2(C2) R29.2(R2) U8.1(1A)
HALL_TRIG2: C12.2(C2) R30.2(R2) U8.3(2A)
HALL_TRIG3: C13.2(C2) R31.2(R2) U8.6(3A)
HALL_UX: R26.2(R2) R29.1(R1) ; port HALL.HALL_UX
HALL_UX_CTRL: U7.38(HALL_UX) U8.7(1Y)
HALL_V: R27.2(R2) R30.1(R1) ; port HALL.HALL_V
HALL_V_CTLR: U7.37(HALL_V) U8.5(2Y)
HALL_WY: R28.2(R2) R31.1(R1) ; port HALL.HALL_WY
HALL_WY_CTRL: U7.36(HALL_WY) U8.2(3Y)
LED: D5.1(A) R25.1(R1)
MOTOR_TEMP: C7.2(C2) R20.2(R2) R22.1(R1) U7.22(AGPI_B)
MOTOR_THERM: R16.1 R20.1(R1)
~{RST}: U7.50(~{RST}) ; port ~{RST}
SPI_MISO: U7.9(SPI_MISO) ; port SPI_CTRL.SPI_MISO
SPI_MOSI: U7.8(SPI_MOSI) ; port SPI_CTRL.SPI_MOSI
SPI_SCK: U7.7(SPI_SCK) ; port SPI_CTRL.SPI_SCK
STATUS: R25.2(R2) U7.12(STATUS)
UH: U7.39(PWM_UX1_H) ; port PWM.UH
UL: U7.40(PWM_UX1_L) ; port PWM.UL
VCCCORE1: C17.2(C2) U7.15(VCCCORE1)
VCCCORE2: C18.2(C2) U7.45(VCCCORE2)
VCCCORE3: C19.2(C2) U7.63(VCCCORE3)
VH: U7.41(PWM_VX2_H) ; port PWM.VH
VL: U7.42(PWM_VX2_L) ; port PWM.VL
WH: U7.46(PWM_WY1_H) ; port PWM.WH
WL: U7.47(PWM_WY1_L) ; port PWM.WL
~DBGSPI_CS: U7.75(GPIO3/AGPI_A_MCD/~{DBGSPI_CS}) ; port DBGSPI.~DBGSPI_CS

Not connected (* = marked no-connect by the designer): U7 10(UART_RXD)* 11(UART_TXD)* 25(AENC_UX_POS)* 26(AENC_UX_NEG)* 27(AENC_VN_POS)* 28(AENC_VN_NEG)* 29(AENC_WY_POS)* 30(AENC_WY_NEG)* 31(BRAKE)* 48(PWM_Y2_H)* 49(PWM_Y2_L)* 56(DIR)* 57(STEP)* 58(PWM_I)* 64(ENC2_A)* 65(ENC2_B)* 66(ENC2_N)* 67(REF_L)* 68(REF_H)* 69(REF_R)* 71(GPIO1/ADC_I1_MCD)* 74(GPIO2/ADC_VM_MCD)*

### Channels
Trinamic Controller 0: designators end in A; ports CTRL_EN=CTRL_EN_ISO DRV_EN=DRV_EN FAULT=FAULT ~{RST}=~RST_ISO
Trinamic Controller 1: designators end in B; ports CTRL_EN=CTRL_EN_ISO DRV_EN=DRV_EN FAULT=FAULT ~{RST}=~RST_ISO
Trinamic Controller 2: designators end in C; ports CTRL_EN=CTRL_EN_ISO DRV_EN=DRV_EN FAULT=FAULT ~{RST}=~RST_ISO
Trinamic Controller 3: designators end in D; ports CTRL_EN=CTRL_EN_ISO DRV_EN=DRV_EN FAULT=FAULT ~{RST}=~RST_ISO

### Notes on the sheet
- (near U7) VDD is 3.3V (MCU digital power supply). VDD = digital , VDDA = analog
- (near R35) check the freq
- Put caps near vdd pins

### Library data of the parts
C5-C8 C10 C14 C16-C19 C25-C30 = CAP 100nF 50V: as C60 on sheet driver-power-stage; Value: 100nF; Rating: 50V; Part Number: CAP 100nF 50V; Supplier 1: Digi-Key; Supplier Part Number 1: 311-3567-1-ND; Manufacturer Part Number 2: 0805J0500104KJT; Supplier 2: Digi-Key; Supplier Part Number 2: 1608-1458-1-ND
C11-C13 = CAP 1000pF 50V: Default Symbol for Capacitors; Manufacturer Part Number 1: 06035C102K4Z2A / 06035C102K4Z2A; Tolerance: 10%; Temperature Coefficient: X7R; Part Number: CAP 1000pF 50V; Supplier 1: Digi-Key; Supplier Part Number 1: 478-6342-1-ND; Manufacturer Part Number 2: 08055C102KAT2A; Supplier 2: Digi-Key; Supplier Part Number 2: 478-1371-1-ND
C15 C23 = CAP 4.7uF 16V: Default Symbol for Capacitors; Manufacturer Part Number 1: C1608X5R1C475K080AE; Tolerance: 10%; Temperature Coefficient: X5R; Part Number: CAP 4.7uF 16V; Supplier 1: Digi-Key; Supplier Part Number 1: 445-175225-1-ND; Manufacturer Part Number 2: C2012X5R1C475K085AB; Supplier 2: Digi-Key; Supplier Part Number 2: 445-14382-1-ND
C20-C22 = CAP 100pF 50V: Default Symbol for Capacitors; Manufacturer Part Number 1: C0603C101K5RAC7867; Tolerance: 10%; Temperature Coefficient: X7R; Part Number: CAP 100pF 50V; Supplier 1: Digi-Key; Supplier Part Number 1: 399-C0603C101K5RAC7867CT-ND; Manufacturer Part Number 2: C0805C101J5RAC7800; Supplier 2: Digi-Key; Supplier Part Number 2: 399-17420-1-ND
C24 = CAP 470nF 50V: as C61 on sheet driver-power-stage; Value: 470nF; Rating: 50V; Part Number: CAP 470nF 50V; Supplier 1: Digi-Key; Supplier Part Number 1: 445-5952-1-ND; Manufacturer Part Number 2: CL21B474KBFNNNG; Supplier 2: Digi-Key; Supplier Part Number 2: 1276-6482-1-ND
D5 = LED GREEN SMD 0603: LED Uni-Color Green 574nm 2-Pin Chip LED T/R; Manufacturer Part Number 1: LTST-C190KGKT; Current Rating: 20mA; Supplier 1: Digi-Key; Supplier Part Number 1: 160-1435-1-ND; Part Number: LED GREEN SMD 0603; Supplier URL 1: https://www.digikey.ca/en/products/detail/lite-on-inc/LTST-C190KGKT/386815?s=N4IgTCBcDaIIwDYAMBaOAWAzAVjSgcgCIgC6AvkA; Pin Count: 2; Voltage Rating - DC: 2V
FB1 = FERRITE BEAD 200 MOHM 0603 1LN: WURTH ELEKTRONIK - 742792651 - Ferrite Bead, 0603 [1608 Metric], 600 ohm, 1 A, WE-CBF Series, 0.2 ohm, &#177; 25%; VALUE: 600R/1A @ 100 MHz; Supplier 1: Digi-Key; Supplier Part Number 1: 732-1593-1-ND; Part Number: FERRITE BEAD 200 MOHM 0603 1LN; Supplier URL 1: https://www.digikey.ca/en/products/detail/w%C3%BCrth-elektronik/742792651/1638997?s=N4IgTCBcDaIOwGYwFoCMBWAnAtyByAIiALoC%2BQA; Manufacturer Part Number 1: 742792651
R16 = RES NTC 10k TH: Manufacturer Part Number 1: NXRT15XH103FA1B040; Tolerance: 1%; Part Number: RES NTC 10k TH; Value: 10k; Supplier 1: Digi-Key; Supplier Part Number 1: 490-7167-ND; Supplier URL 1: https://www.digikey.ca/en/products/detail/murata-electronics/NXRT15XH103FA1B040/3900399?s=N4IgTCBcDaICwE4AMBaA7ARgGxpQOQBEQBdAXyA
R17 = RES NTC 10k CHIP: Manufacturer Part Number 1: NCU18XH103F60RB; Tolerance: 1%; Part Number: RES NTC 10k CHIP; Value: 10k; Supplier 1: Digi-Key; Supplier Part Number 1: 490-16279-1-ND; Supplier URL 1: https://www.digikey.ca/en/products/detail/murata-electronics/NCU18XH103F60RB/7363023?s=N4IgTCBcDaICwE4AMBaAjANjAdgelAcgCIgC6AvkA
R18 = RES 47k 1/8W - 1%: Default Resistor Symbol; Manufacturer Part Number 1: MCT06030C4702FP500; Power (Watts): 0.125W; Tolerance: 1%; Package: 0805; Value: 47k; Part Number: RES 47k 1/8W - 1%; Supplier 1: Digi-Key; Supplier Part Number 1: MCT0603-47.0K-CFCT-ND; Manufacturer Part Number 2: AC0805FR-0747KL; Supplier 2: Digi-Key; Supplier Part Number 2: YAG3735CT-ND; Tolerance 2: 1%; Supplier URL 1: https://www.digikey.ca/en/products/detail/vishay-beyschlag-draloric-bc-components/MCT06030C4702FP500/2607854?s=N4IgTCBcDaILIGEAqAGAbCgzAWgCwHYA6FAaWwQDFlsA5AERAF0BfIA; Supplier URL 2: https://www.digikey.ca/en/products/detail/yageo/AC0805FR-0747KL/5896858?s=N4IgTCBcDaIJoEEDiBmA7CgrAYQCoFoA5AERAF0BfIA
R19 R35-R37 = RES 1k 1/8W - 1%: Default Resistor Symbol; Manufacturer Part Number 1: MCT06030C1001FP500; Power (Watts): 0.125W; Tolerance: 1%; Package: 0805; Value: 1k; Part Number: RES 1k 1/8W - 1%; Supplier 1: Digi-Key; Supplier Part Number 1: MCT0603-1.00K-CFCT-ND; Manufacturer Part Number 2: RMCF0805FT1K00; Supplier 2: Digi-Key; Supplier Part Number 2: RMCF0805FT1K00CT-ND; Tolerance 2: 1%; Supplier URL 1: https://www.digikey.ca/en/products/detail/vishay-beyschlag-draloric-bc-components/MCT06030C1001FP500/2607821?s=N4IgTCBcDaILIGEAqAGAbCgzAWgIwDoUUBpbBAMWWwDkAREAXQF8g; Supplier URL 2: https://www.digikey.ca/en/products/detail/stackpole-electronics-inc/RMCF0805FT1K00/1760090?s=N4IgTCBcDaIEoFkDCAxADADjQVhQFQEYBpNNJPEAXQF8g
R20-R23 = RES 4.7k 1/8W - 1%: Default Resistor Symbol; Manufacturer Part Number 1: RMCF0603FT4K70; Power (Watts): 0.125W; Tolerance: 1%; Package: 0805; Value: 4.7k; Part Number: RES 4.7k 1/8W - 1%; Supplier 1: Digi-Key; Supplier Part Number 1: RMCF0603FT4K70CT-ND; Supplier URL 1: https://www.digikey.ca/en/products/detail/stackpole-electronics-inc/RMCF0603FT4K70/1760998
R25 = RES 110.0 1/8W - 1%: as R78 on sheet driver-power-stage; Package: 0805; Value: 110; Part Number: RES 110.0 1/8W - 1%; Supplier 1: Digi-Key; Supplier Part Number 1: RMCF0603FT110RCT-ND; Supplier URL 1: https://www.digikey.ca/en/products/detail/stackpole-electronics-inc/RMCF0603FT110R/1761268
R26-R34 = RES 4.7k 1/8W - 5%: Default Resistor Symbol; Manufacturer Part Number 1: RMCF0603JT4K70; Power (Watts): 0.125W; Tolerance: 5%; Package: 0805; Value: 4.7k; Part Number: RES 4.7k 1/8W - 5%; Supplier 1: Digi-Key; Supplier Part Number 1: RMCF0603JT4K70CT-ND; Supplier URL 1: https://www.digikey.ca/en/products/detail/stackpole-electronics-inc/RMCF0603JT4K70/1757976
TP11 TP12 = Test Point (Via): Part Number: Test Point (Via)
U7 = TMC4671: Motor Driver, -40 To 125Deg C Rohs Compliant: Yes; Supplier 1: Digi-Key; Supplier Part Number 1: 1460-TMC4671-LA-ND; Part Number: TMC4671; Supplier URL 1: https://www.digikey.ca/en/products/detail/trinamic-motion-control-gmbh/TMC4671-LA/12174669?s=N4IgTCBcDaIIwBYBsAGAtAFQLIGFkHY40AZAQTQDkAREAXQF8g; Manufacturer Part Number 1: TMC4671-LA
U8 U9 = IC 74LVC3G17DC,125: IC BUFFER TRIPLE SCHMITT TRIGGER 5.5V VSSOP-8; Supplier 1: Newark; Supplier Part Number 1: 33AC1281; Part Number: IC 74LVC3G17DC,125; Supplier URL 1: https://canada.newark.com/nexperia/74lvc3g17dc-125/buffer-non-inverting-triple-vssop/dp/33AC1281?ost=33ac1281; Manufacturer Part Number 1: 74LVC3G17DC,125
X1 = XTAL OSC 25MHz 3.3V: Oscillator XO 25MHz ±15ppm 15pF CMOS 55% 2.5V/3.3V 4-Pin Mini-CSMD T/R; Frequency: 32.768kHz; Load Capacitance: 12.5pF; Supplier 1: Digi-Key; Supplier Part Number 1: 1253-1254-6-ND; Part Number: XTAL OSC 25MHz 3.3V; Supplier URL 1: https://www.digikey.ca/en/products/detail/kyocera-avx/KC2520C25-0000C2LE00/4867084?s=N4IgTCBcDaIIxgKwGYC0DEBZUDZUDkAREAXQF8g; Manufacturer Part Number 1: KC2520C25.0000C2LE00

## Sheet connectors.SchDoc
size A4; SheetNumber: 13; SheetTotal: 13
Used 4 times, as channels Connectors 0, Connectors 1, Connectors 2, Connectors 3. Parts and nets are listed once, with the designators drawn on the sheet.
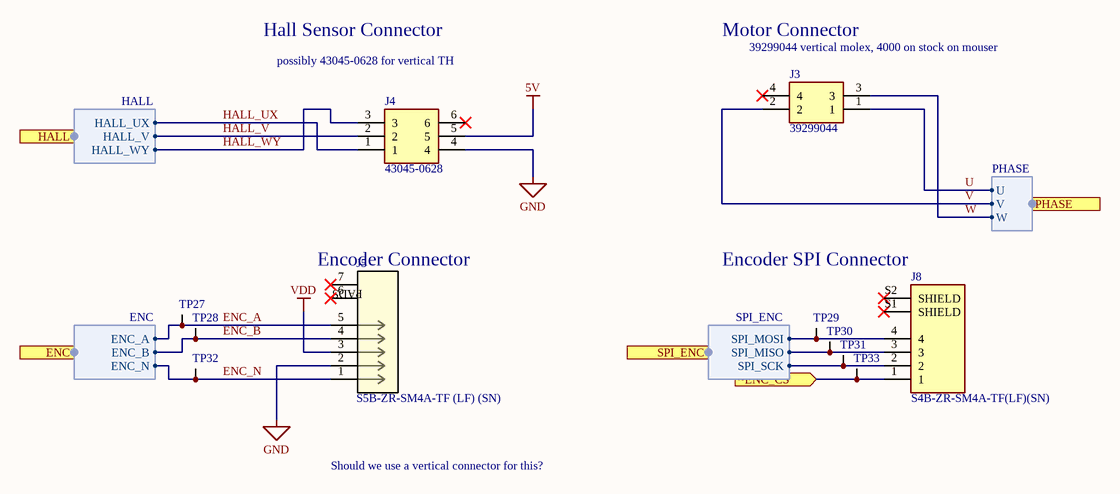
[diagram p3: connectors.SchDoc]

### Parts
J3  39299044  [39299044]
J4  43045-0628  [430450628]
J5  S5B-ZR-SM4A-TF (LF) (SN)  [JST_S5B-ZR-SM4A-TF]
J8  S4B-ZR-SM4A-TF(LF)(SN)  [JST_S4B-ZR-SM4A-TF(LF)(SN)]
TP27  ENC_A  [TP]  (value not drawn)  (no BOM)
TP28  ENC_B  [TP]  (value not drawn)  (no BOM)
TP29  MOSI  [TP]  (value not drawn)  (no BOM)
TP30  MISO  [TP]  (value not drawn)  (no BOM)
TP31  SCK  [TP]  (value not drawn)  (no BOM)
TP32  ENC_N  [TP]  (value not drawn)  (no BOM)
TP33  ENC_CS  [TP]  (value not drawn)  (no BOM)

### Ports
ENC (harness ENC), HALL (harness HALL), PHASE (harness PHASE), SPI_ENC (harness SPI_ENC), ~ENC_CS (in)

### Harnesses
HALL: HALL_UX, HALL_WY, HALL_V
ENC: ENC_A, ENC_N, ENC_B
PHASE: U, V, W
SPI_ENC: SPI_SCK, SPI_MISO, SPI_MOSI

### Nets
5V: J4.5
GND: J4.4 J5.2
VDD: J5.3
ENC_A: J5.5 TP27.1 ; port ENC.ENC_A
ENC_B: J5.4 TP28.1 ; port ENC.ENC_B
ENC_N: J5.1 TP32.1 ; port ENC.ENC_N
HALL_UX: J4.1 ; port HALL.HALL_UX
HALL_V: J4.2 ; port HALL.HALL_V
HALL_WY: J4.3 ; port HALL.HALL_WY
U: J3.1 ; port PHASE.U
V: J3.2 ; port PHASE.V
W: J3.3 ; port PHASE.W
~ENC_CS: J8.1 TP33.1 ; port ~ENC_CS
NetJ8_2: J8.2 TP31.1 ; port SPI_ENC.SPI_SCK
NetJ8_3: J8.3 TP30.1 ; port SPI_ENC.SPI_MISO
NetJ8_4: J8.4 TP29.1 ; port SPI_ENC.SPI_MOSI

Not connected (* = marked no-connect by the designer): J3 4*; J4 6*; J5 6* 7*; J8 S1(SHIELD)* S2(SHIELD)*

### Channels
Connectors 0: designators end in A; ports ~ENC_CS=~ENC_CS0
Connectors 1: designators end in B; ports ~ENC_CS=~ENC_CS1
Connectors 2: designators end in C; ports ~ENC_CS=~ENC_CS2
Connectors 3: designators end in D; ports ~ENC_CS=~ENC_CS3

### Notes on the sheet
- Hall Sensor Connector
- Motor Connector
- (near J3) 39299044 vertical molex, 4000 on stock on mouser
- possibly 43045-0628 for vertical TH
- (near J5) Encoder Connector
- (near J8) Encoder SPI Connector
- Should we use a vertical connector for this?
- (in symbol CN 5POS JST ZR RA) PADS

### Library data of the parts
J3 = CN HDR 4POS Molex 39299044 VERT: Molex 39299044 4POS Minifit / dual row, vertical; Supplier 1: Digi-Key; Supplier Part Number 1: WM7336-ND; Part Number: CN HDR 4POS Molex 39299044 VERT; Supplier URL 1: https://www.digikey.ca/en/products/detail/molex/0039299044/1624292?s=N4IgTCBcDaIOoFkDsBmFA2AtAOQCIgF0BfIA; Pin Count: 4; Manufacturer Part Number 1: 39299044
J4 = CN HDR 6POS Molex 43045-0628: Molex 43045-0628 6POS Microfit / dual row, Vertical; Supplier 1: Digi-Key; Supplier Part Number 1: WM10679-ND; Part Number: CN HDR 6POS Molex 43045-0628; Supplier URL 1: https://www.digikey.ca/en/products/detail/molex/0430450628/3310200?s=N4IgTCBcDaICwGYAMcCsSBsYAcAdXIAugL5A; Pin Count: 6; Manufacturer Part Number 1: 430450628
J5 = CN 5POS JST ZR RA: Connector Header Surface Mount, Right Angle 5 position 0.059" (1.50mm); Supplier 1: Digi-Key; Supplier Part Number 1: 455-1696-1-ND; Part Number: CN 5POS JST ZR RA; Supplier URL 1: https://www.digikey.ca/en/products/detail/jst-sales-america-inc/S5B-ZR-SM4A-TF-LF-SN/926603?s=N4IgTCBcDaICwFYEFoCMA2AnOtyByAIiALoC%2BQA; Pin Count: 5; Manufacturer Part Number 1: S5B-ZR-SM4A-TF
J8 = CN 4POS JST ZR RA: Connector Header Surface Mount, Right Angle 4 position 0.059 (1.50mm); MF: JST Sales; SnapEDA_Link: https://www.snapeda.com/parts/S4B-ZR-SM4A-TF(LF)(SN)/JST%20Sales%20America%20Inc./view-part/449060/?ref=snap; Availability: Unavailable; Value: *; Price: None; Arrow_Electronics-Purchase-URL: https://snapeda.com/shop?store=Arrow+Electronics&id=449060; MP: S4B-ZR-SM4A-TF(LF)(SN); Package: None; Part Number: CN 4POS JST ZR RA; Supplier 1: Digi-Key; Supplier Part Number 1: 455-1695-1-ND; Supplier URL 1: https://www.digikey.ca/en/products/detail/jst-sales-america-inc/S4B-ZR-SM4A-TF-LF-SN/926602?s=N4IgTCBcDaIMoBYBCBaAWgJRXAsgggigCoBiAFADIkCUZcActSALoC%2BQA; Pin Count: 4
TP27-TP33 = Test Point (Via): Part Number: Test Point (Via)

## Sheet current_amplification.SchDoc
size A4; SheetNumber: 10; SheetTotal: 13
Used 5 times, as channels Current Amplification 0, Current Amplification 4, Current Amplification 1, Current Amplification 2, Current Amplification 3. Parts and nets are listed once, with the designators drawn on the sheet.
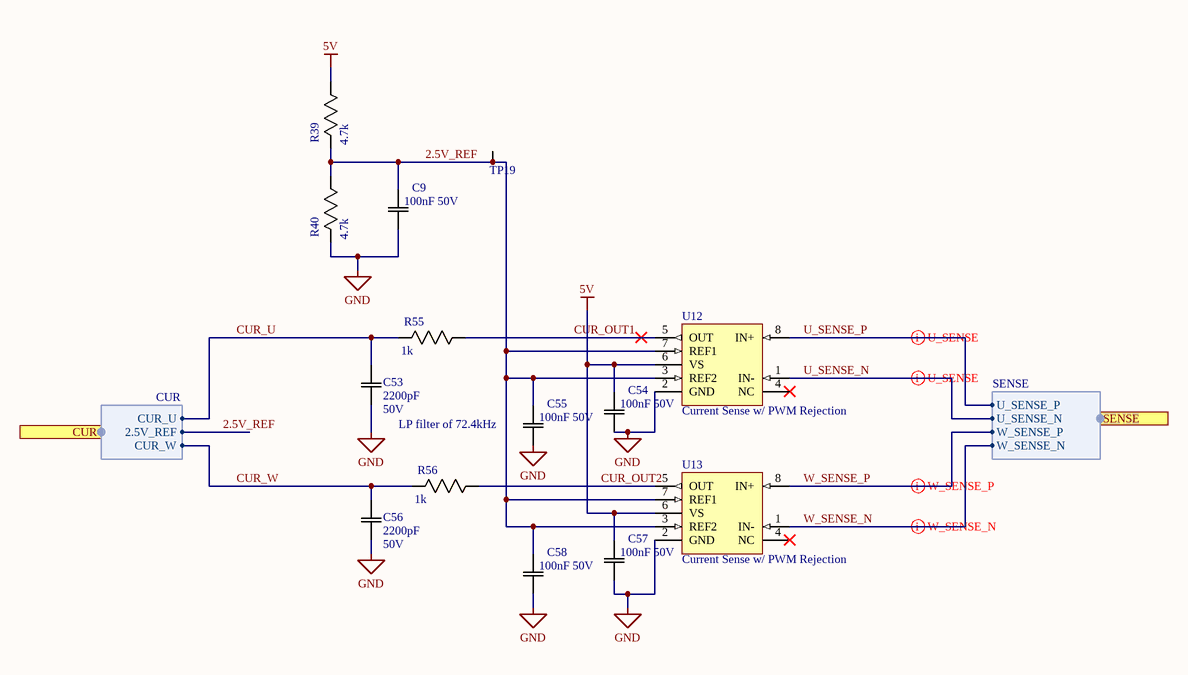
[diagram p4: current_amplification.SchDoc]

### Parts
C9  100nF 50V  [0603]
C53  value 2200pF  Rating: 50V  [0603]  (hidden comment: 2200pF 50V)
C54  100nF 50V  [0603]
C55  100nF 50V  [0603]
C56  value 2200pF  Rating: 50V  [0603]  (hidden comment: 2200pF 50V)
C57  100nF 50V  [0603]
C58  100nF 50V  [0603]
R39  4.7k  [0603]
R40  4.7k  [0603]
R55  1k  [0603]
R56  1k  [0603]
TP19  2.5V  [TP]  (value not drawn)  (no BOM)
U12  Current Sense w/ PWM Rejection  [8-SOIC]
U13  Current Sense w/ PWM Rejection  [8-SOIC]

### Ports
CUR (harness CUR), SENSE (harness SENSE)

### Harnesses
CUR: CUR_U, CUR_W, 2.5V_REF
SENSE: U_SENSE_P, U_SENSE_N, W_SENSE_P, W_SENSE_N

### Nets
5V: C54.2(C2) C57.2(C2) R39.1(R1) U12.6(VS) U13.6(VS)
GND: C9.1(C1) C53.1(C1) C54.1(C1) C55.1(C1) C56.1(C1) C57.1(C1) C58.1(C1) R40.2(R2) U12.2(GND) U13.2(GND)
2.5V_REF: C9.2(C2) C55.2(C2) C58.2(C2) R39.2(R2) R40.1(R1) TP19.1 U12.3(REF2) U12.7(REF1) U13.3(REF2) U13.7(REF1) ; port CUR.2.5V_REF
CUR_OUT1: R55.1(R1) U12.5(OUT)
CUR_OUT2: R56.1(R1) U13.5(OUT)
CUR_U: C53.2(C2) R55.2(R2) ; port CUR.CUR_U
CUR_W: C56.2(C2) R56.2(R2) ; port CUR.CUR_W
U_SENSE_N: U12.1(IN-) ; port SENSE.U_SENSE_N
U_SENSE_P: U12.8(IN+) ; port SENSE.U_SENSE_P
W_SENSE_N: U13.1(IN-) ; port SENSE.W_SENSE_N
W_SENSE_P: U13.8(IN+) ; port SENSE.W_SENSE_P

Not connected (* = marked no-connect by the designer): U12 4(NC)*; U13 4(NC)*

### Channels
Current Amplification 0: designators end in A
Current Amplification 4: designators end in B
Current Amplification 1: designators end in C
Current Amplification 2: designators end in D
Current Amplification 3: designators end in E

### Layout directives
differential pair: U_SENSE_N, U_SENSE_P, W_SENSE_N, W_SENSE_P

### Notes on the sheet
- (near C55) LP filter of 72.4kHz

### Library data of the parts
C9 C54 C55 C57 C58 = CAP 100nF 50V: as C60 on sheet driver-power-stage; VALUE: 100nF; Rating: 50V; Part Number: CAP 100nF 50V; Supplier 1: Digi-Key; Supplier Part Number 1: 311-3567-1-ND; Manufacturer Part Number 2: 0805J0500104KJT; Supplier 2: Digi-Key; Supplier Part Number 2: 1608-1458-1-ND
C53 C56 = CAP 2200pF 50V: Default Symbol for Capacitors; Manufacturer Part Number 1: 06035C222KAT2A; Tolerance: 10%; Temperature Coefficient: X7R; Part Number: CAP 2200pF 50V; Supplier 1: Digi-Key; Supplier Part Number 1: 478-1219-1-ND; Manufacturer Part Number 2: CL21B222KBANNNC; Supplier 2: Digi-Key; Supplier Part Number 2: 1276-1171-1-ND
R39 R40 = RES 4.7k 1/8W - 1%: as R20 on sheet trinamic-controller; Package: 0805; VALUE: 4.7k; Part Number: RES 4.7k 1/8W - 1%; Supplier 1: Digi-Key; Supplier Part Number 1: RMCF0603FT4K70CT-ND; Supplier URL 1: https://www.digikey.ca/en/products/detail/stackpole-electronics-inc/RMCF0603FT4K70/1760998
R55 R56 = RES 1k 1/8W - 1%: as R19 on sheet trinamic-controller; Package: 0805; VALUE: 1k; Part Number: RES 1k 1/8W - 1%; Supplier 1: Digi-Key; Supplier Part Number 1: MCT0603-1.00K-CFCT-ND; Manufacturer Part Number 2: RMCF0805FT1K00; Supplier 2: Digi-Key; Supplier Part Number 2: RMCF0805FT1K00CT-ND; Tolerance 2: 1%; Supplier URL 1: https://www.digikey.ca/en/products/detail/vishay-beyschlag-draloric-bc-components/MCT06030C1001FP500/2607821?s=N4IgTCBcDaILIGEAqAGAbCgzAWgIwDoUUBpbBAMWWwDkAREAXQF8g; Supplier URL 2: https://www.digikey.ca/en/products/detail/stackpole-electronics-inc/RMCF0805FT1K00/1760090?s=N4IgTCBcDaIEoFkDCAxADADjQVhQFQEYBpNNJPEAXQF8g
TP19 = Test Point (Via): Part Number: Test Point (Via)
U12 U13 = INA240A3EDRQ1: SP Amp Current Sense Amp Single R-R O/P 5.5V Automotive 6-Pin SC-70 T/R; Part Number: INA240A3EDRQ1; Manufacturer Part Number 1: INA240A3EDRQ1; Supplier 1: Digi-Key; Supplier Part Number 1: 296-53154-1-ND; Supplier URL 1: https://www.digikey.ca/en/products/detail/texas-instruments/INA240A3EDRQ1/9861456?s=N4IgTCBcDaIJIDkCCYAsAGJBmAogEQCUBFARhAF0BfIA

## Sheet power.SchDoc
size A4; SheetNumber: 2; SheetTotal: 13
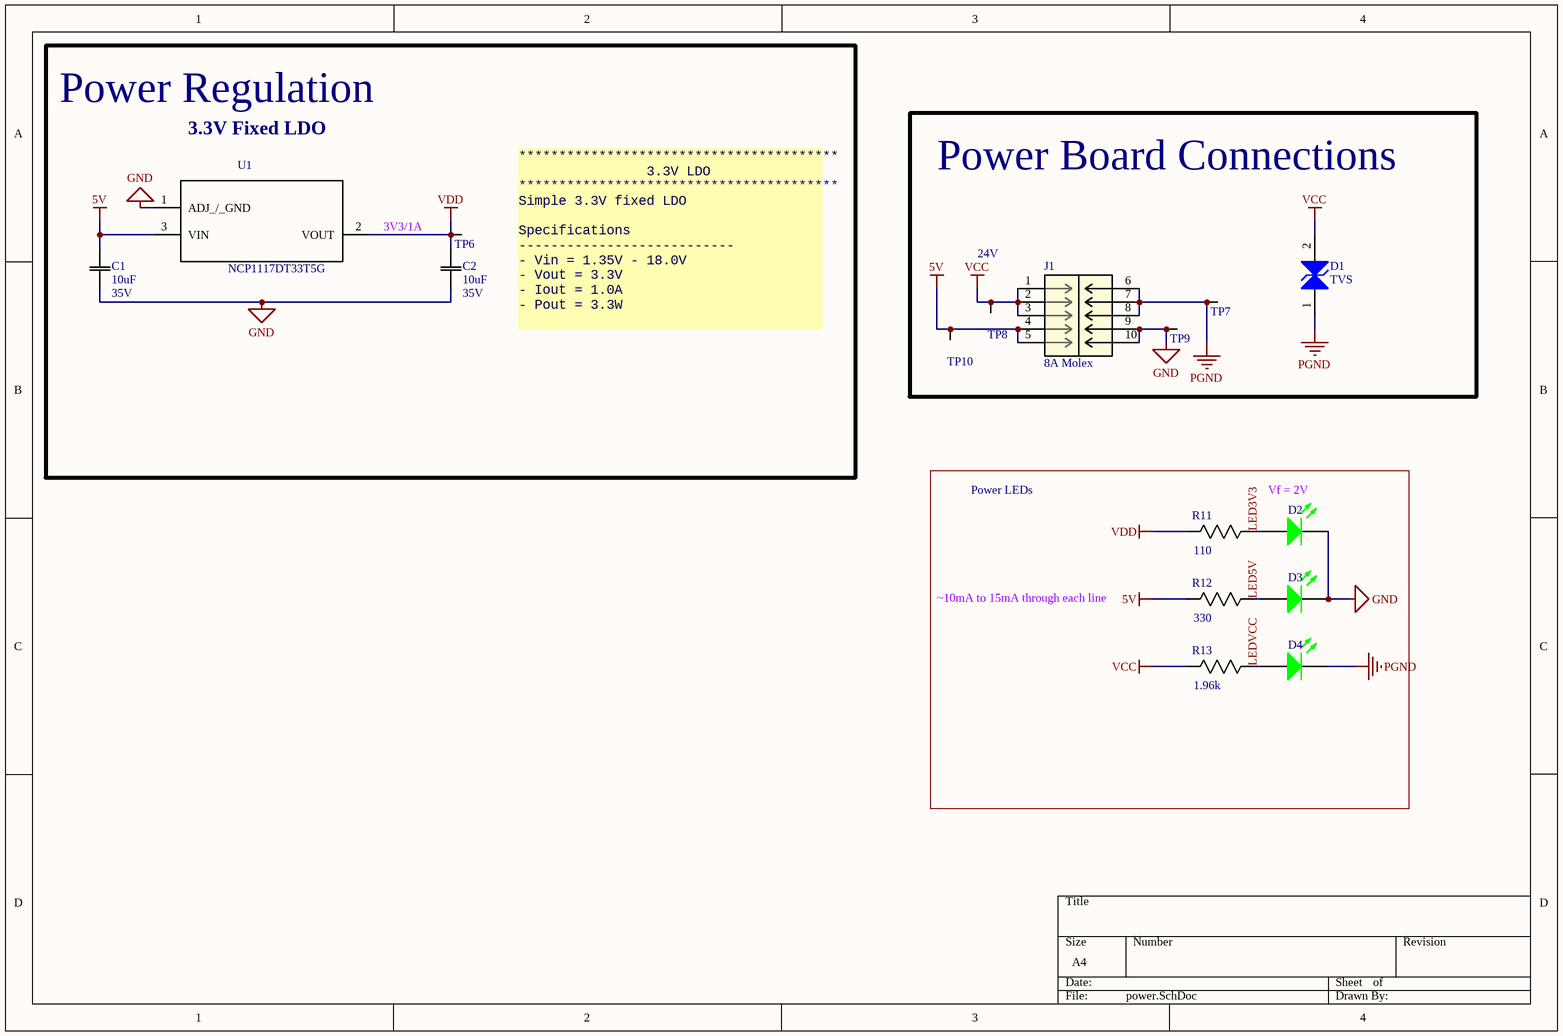
[diagram p5: power.SchDoc]

### Parts
C1  value 10uF  Rating: 35V  [0805]  (hidden comment: 10uF 35V)
C2  value 10uF  Rating: 35V  [0805]  (hidden comment: 10uF 35V)
D1  TVS  [DO-214AC, SMA]
D2  0603 2V  [0603 - LED]  (value not drawn)
D3  0603 2V  [0603 - LED]  (value not drawn)
D4  0603 2V  [0603 - LED]  (value not drawn)
J1  8A Molex  [MOLEX_0430451012]
R11  110  [0603]
R12  330  [0603]
R13  1.96k  [0603]
TP6  VDD  [TP]  (value not drawn)  (no BOM)
TP7  PGND  [TP]  (value not drawn)  (no BOM)
TP8  VCC  [TP]  (value not drawn)  (no BOM)
TP9  GND  [TP]  (value not drawn)  (no BOM)
TP10  5V  [TP]  (value not drawn)  (no BOM)
U1  NCP1117DT33T5G  [DPAK (TO-252)]

### Blocks framed on the sheet
Power Regulation: C1 C2 TP6 U1
Power Board Connections: D1 J1 TP7-TP10

### Nets
5V: C1.2(C2) J1.4 J1.5 R12.2(R2) TP10.1 U1.3(VIN)
GND: C1.1(C1) C2.1(C1) D2.2(K) D3.2(K) J1.9 J1.10 TP9.1 U1.1(ADJ_/_GND)
PGND: D1.1(K) D4.2(K) J1.6 J1.7 J1.8 TP7.1
VCC: D1.2(A) J1.1 J1.2 J1.3 R13.2(R2) TP8.1
VDD: C2.2(C2) R11.2(R2) TP6.1 U1.2(VOUT)
LED3V3: D2.1(A) R11.1(R1)
LED5V: D3.1(A) R12.1(R1)
LEDVCC: D4.1(A) R13.1(R1)

### Notes on the sheet
- 3.3V Fixed LDO
- 3V3/1A
- 24V
- ****************************************
  3.3V LDO
  ****************************************
  Simple 3.3V fixed LDO
  Specifications
  ---------------------------
  - Vin = 1.35V - 18.0V
  - Vout = 3.3V
  - Iout = 1.0A
  - Pout = 3.3W
- Power LEDs
- Vf = 2V
- ~10mA to 15mA through each line

### Library data of the parts
C1 C2 = CAP 10uF 35V_1: Default Symbol for Capacitors; Manufacturer Part Number 1: C2012X5R1V106K125AC; Tolerance: 10%; Temperature Coefficient: X5R; Part Number: CAP 10uF 35V_1; Supplier 1: Digi-Key; Supplier Part Number 1: 445-14418-1-ND
D1 = DIODE TVS 26VWM 53.5VC SMA: TVS DIODE 26V 53.5V SMA; Manufacturer Part Number 1: SMAJ26CA-TR; Power: 400W; Voltage Rating - DC: 26VWM, 53.5VC; Current Rating: 43A; Supplier 1: Digi-Key; Supplier Part Number 1: 497-12523-1-ND; Part Number: DIODE TVS 26VWM 53.5VC SMA; Supplier URL 1: https://www.digikey.ca/en/products/detail/stmicroelectronics/SMAJ26CA-TR/2214530?s=N4IgTCBcDaICwE4DsBaAjGArGAzOlAcgCIgC6AvkA; Pin Count: 2
D2-D4 = LED GREEN SMD 0603: as D5 on sheet trinamic-controller; Part Number: LED GREEN SMD 0603; Supplier 1: Digi-Key; Supplier Part Number 1: 160-1435-1-ND; Supplier URL 1: https://www.digikey.ca/en/products/detail/lite-on-inc/LTST-C190KGKT/386815?s=N4IgTCBcDaIIwDYAMBaOAWAzAVjSgcgCIgC6AvkA; Pin Count: 2; Voltage Rating - DC: 2V
J1 = CN HDR 10POS MOLEX 0430451012: CONN HEADER VERT 10POS 3MM; Supplier 1: Digi-Key; Supplier Part Number 1: WM1793-ND; Part Number: CN HDR 10POS MOLEX 0430451012; Supplier URL 1: https://www.digikey.ca/en/products/detail/molex/0430451012/252506?s=N4IgTCBcDaIAwBYDMiCsBGO6IF0C%2BQA; Pin Count: 10; Manufacturer Part Number 1: 0430451012
R11 = RES 110.0 1/8W - 1%: as R78 on sheet driver-power-stage; Package: 0805; Value: 110; Part Number: RES 110.0 1/8W - 1%; Supplier 1: Digi-Key; Supplier Part Number 1: RMCF0603FT110RCT-ND; Supplier URL 1: https://www.digikey.ca/en/products/detail/stackpole-electronics-inc/RMCF0603FT110R/1761268
R12 = RES 330.0 1/8W - 5%: Default Resistor Symbol; Manufacturer Part Number 1: RMCF0603JT330R; Power (Watts): 0.125W; Tolerance: 5%; Package: 0805; Value: 330; Part Number: RES 330.0 1/8W - 5%; Supplier 1: Digi-Key; Supplier Part Number 1: RMCF0603JT330RCT-ND; Supplier URL 1: https://www.digikey.ca/en/products/detail/stackpole-electronics-inc/RMCF0603JT330R/1757998
R13 = RES 1.96k 1/8W: Default Resistor Symbol; Manufacturer Part Number 1: RC0603FR-071K96L; Power (Watts): 0.125W; Tolerance: 1%; Package: 0805; Value: 1.96k; Part Number: RES 1.96k 1/8W; Supplier 1: Digi-Key; Supplier Part Number 1: 311-1.96KHRCT-ND; Supplier URL 1: https://www.digikey.ca/en/products/detail/yageo/RC0603FR-071K96L/726878
TP6-TP10 = Test Point (Via): Part Number: Test Point (Via)
U1 = NCP1117DT33T5G: Linear Voltage Regulator IC Positive Fixed 1 Output 1A DPAK; Part Number: NCP1117DT33T5G; Manufacturer Part Number 1: NCP1117DT33T5G; Supplier 1: Digi-Key; Supplier Part Number 1: NCP1117DT33T5GOSCT-ND; Supplier URL 1: https://www.digikey.ca/en/products/detail/onsemi/NCP1117DT33T5G/921285